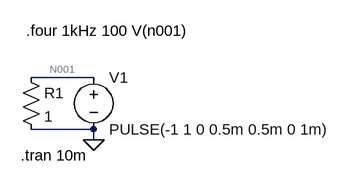
[diagram p0: schematic Atv1p4.asc]
Atv1p4.asc, the LTspice schematic file:
Version 4
SHEET 1 880 680
WIRE 64 112 -32 112
WIRE 64 192 -32 192
WIRE 64 208 64 192
FLAG 64 208 0
SYMBOL voltage 64 96 R0
WINDOW 123 0 0 Left 0
WINDOW 39 0 0 Left 0
SYMATTR InstName V1
SYMATTR Value PULSE(-1 1 0 0.5m 0.5m 0 1m)
SYMBOL res -48 96 R0
SYMATTR InstName R1
SYMATTR Value 1
TEXT -48 232 Left 2 !.tran 10m
TEXT -40 40 Left 2 !.four 1kHz 100 V(n001)

The netlist it stands for:
* Atv1p4.asc
V1 N001 0 PULSE(-1 1 0 0.5m 0.5m 0 1m)
R1 N001 0 1
.tran 10m
.four 1kHz 100 V(n001)
.backanno
.end